# EasyEDA Pro project ProPrj_G4SC5.5开源版.epro, schematic G4SC5.5

## Sheets
1 主控: Board Name: G4SC5.5; Create Date: 2025-05-25; Page Name: 主控; Project Name: G4SC5.5开源版; Schematic Name: G4SC5.5; Update Date: 2025-05-25; Add into BOM: yes; Company: Your Company; Convert to PCB: yes; Date: 2023-09-22; Draw By: SUSTCDREAM; REV: 1.0; Sheet: 1/1
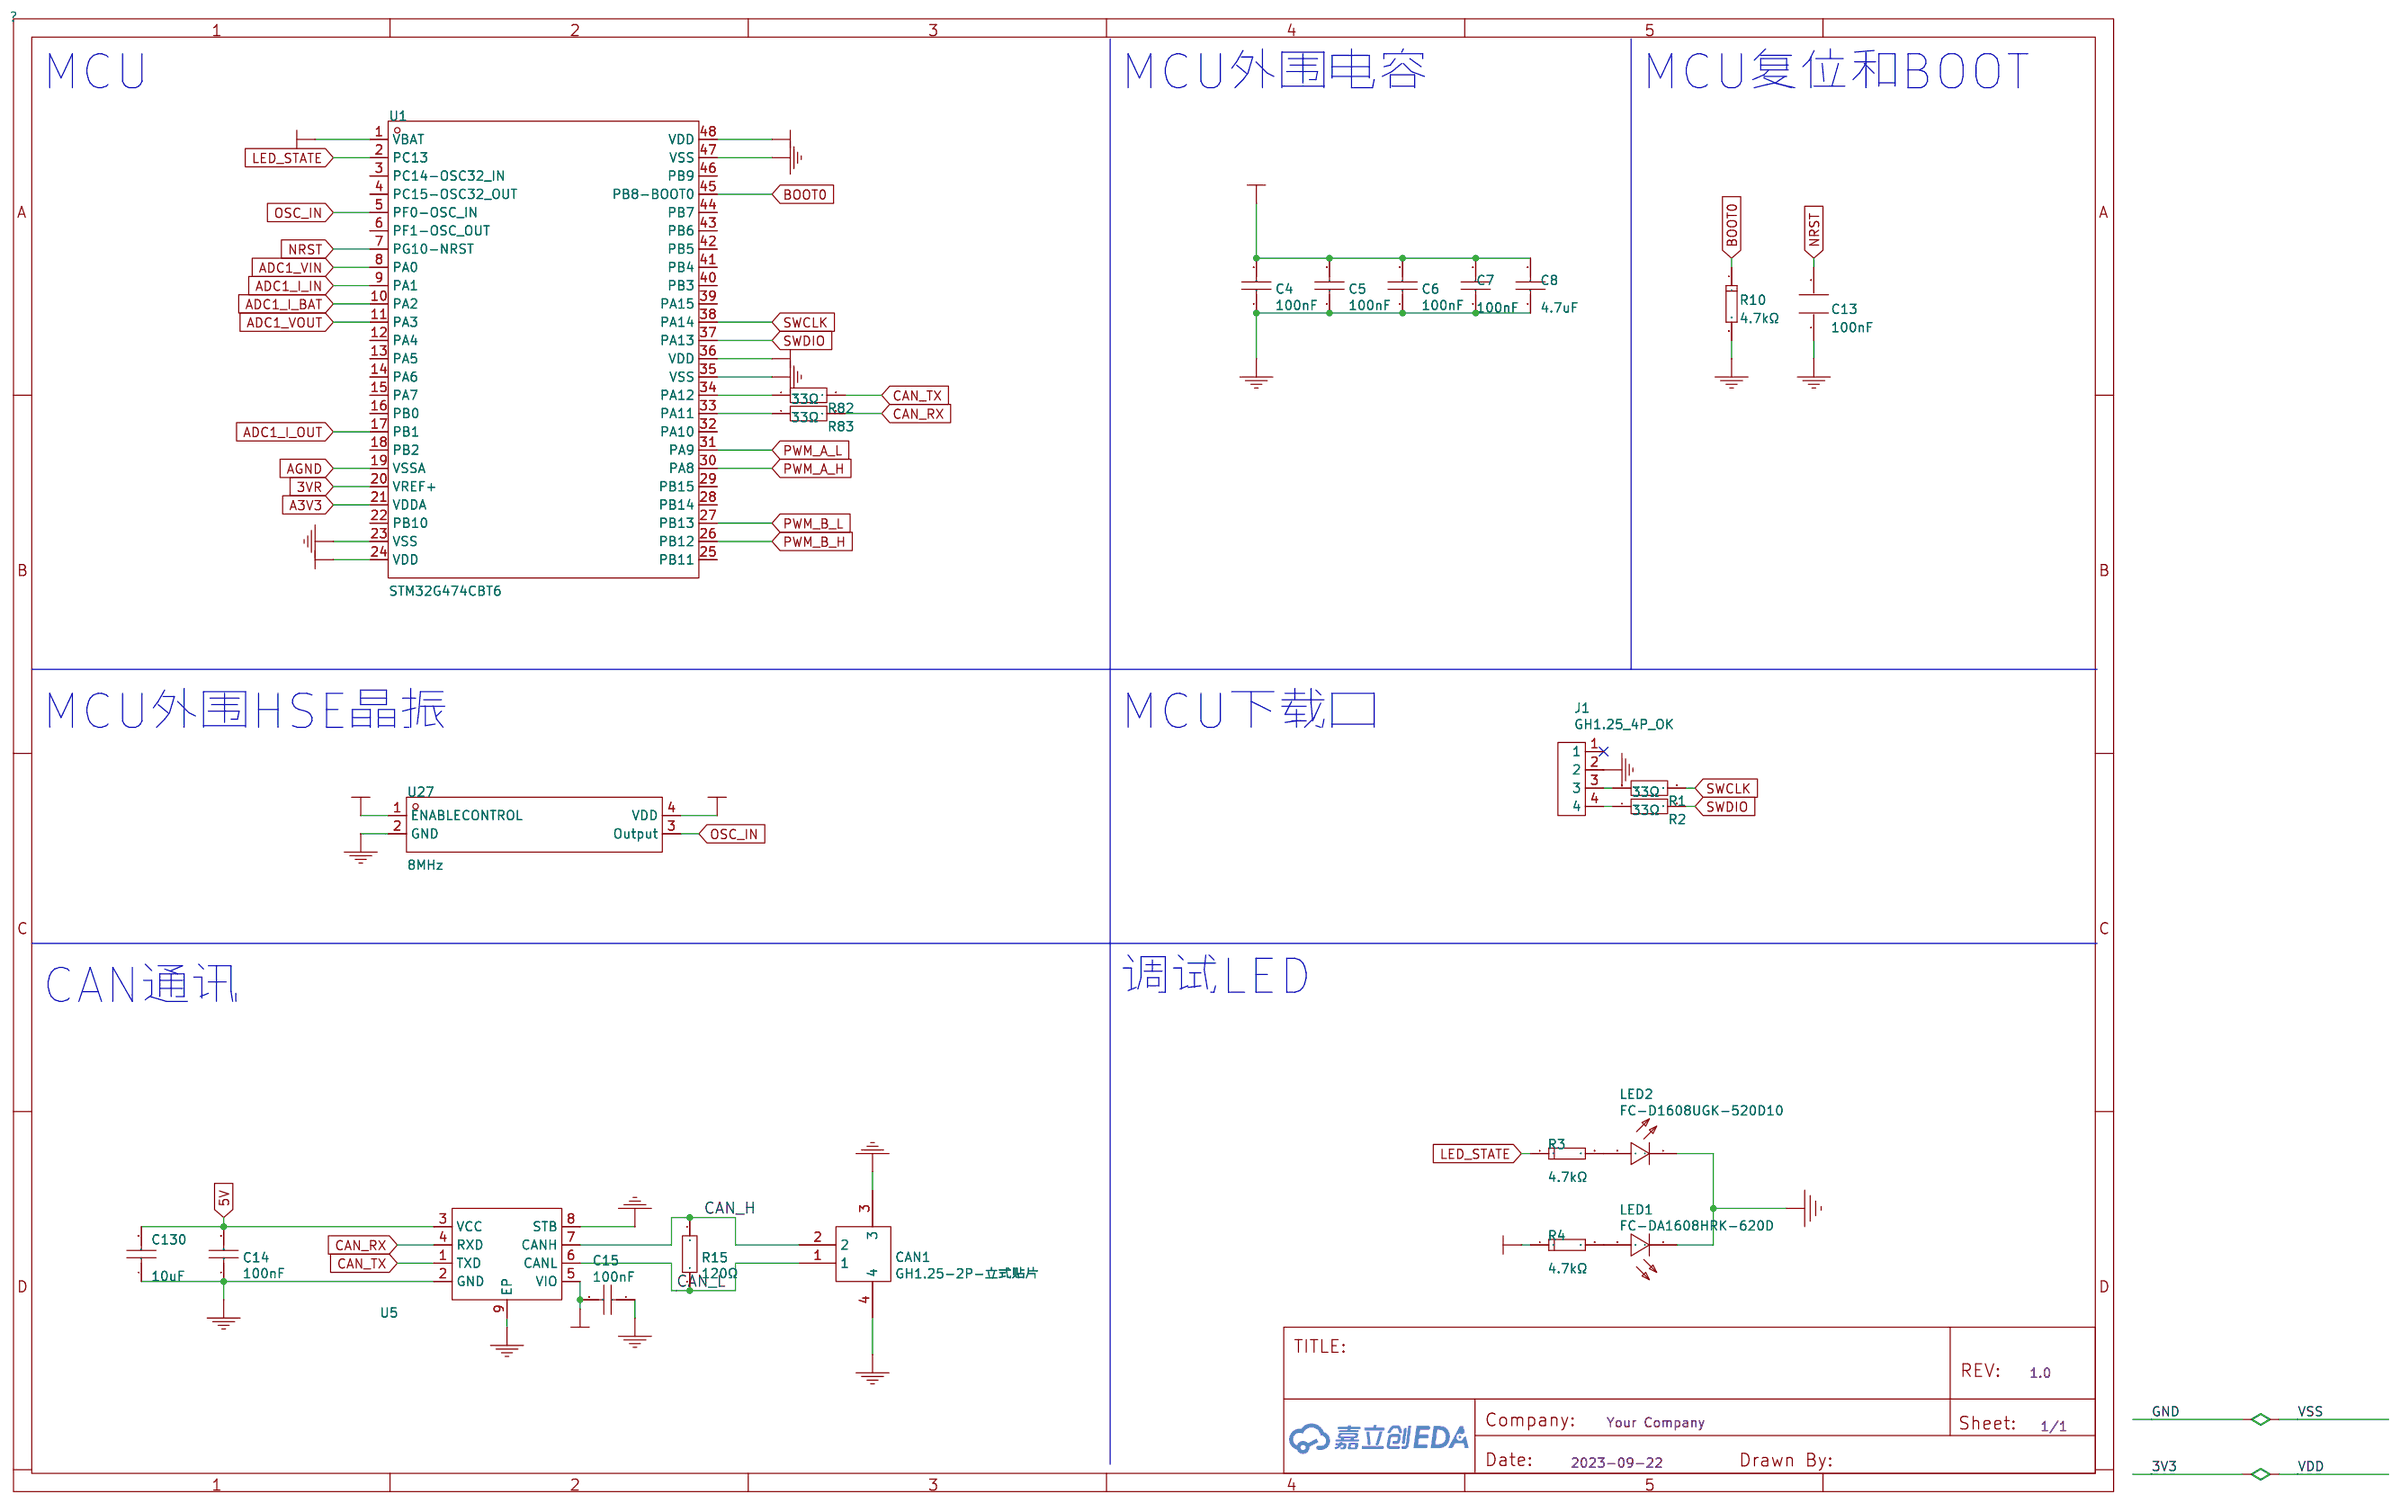
[diagram p0: 主控]
2 供电: Page Name: 供电
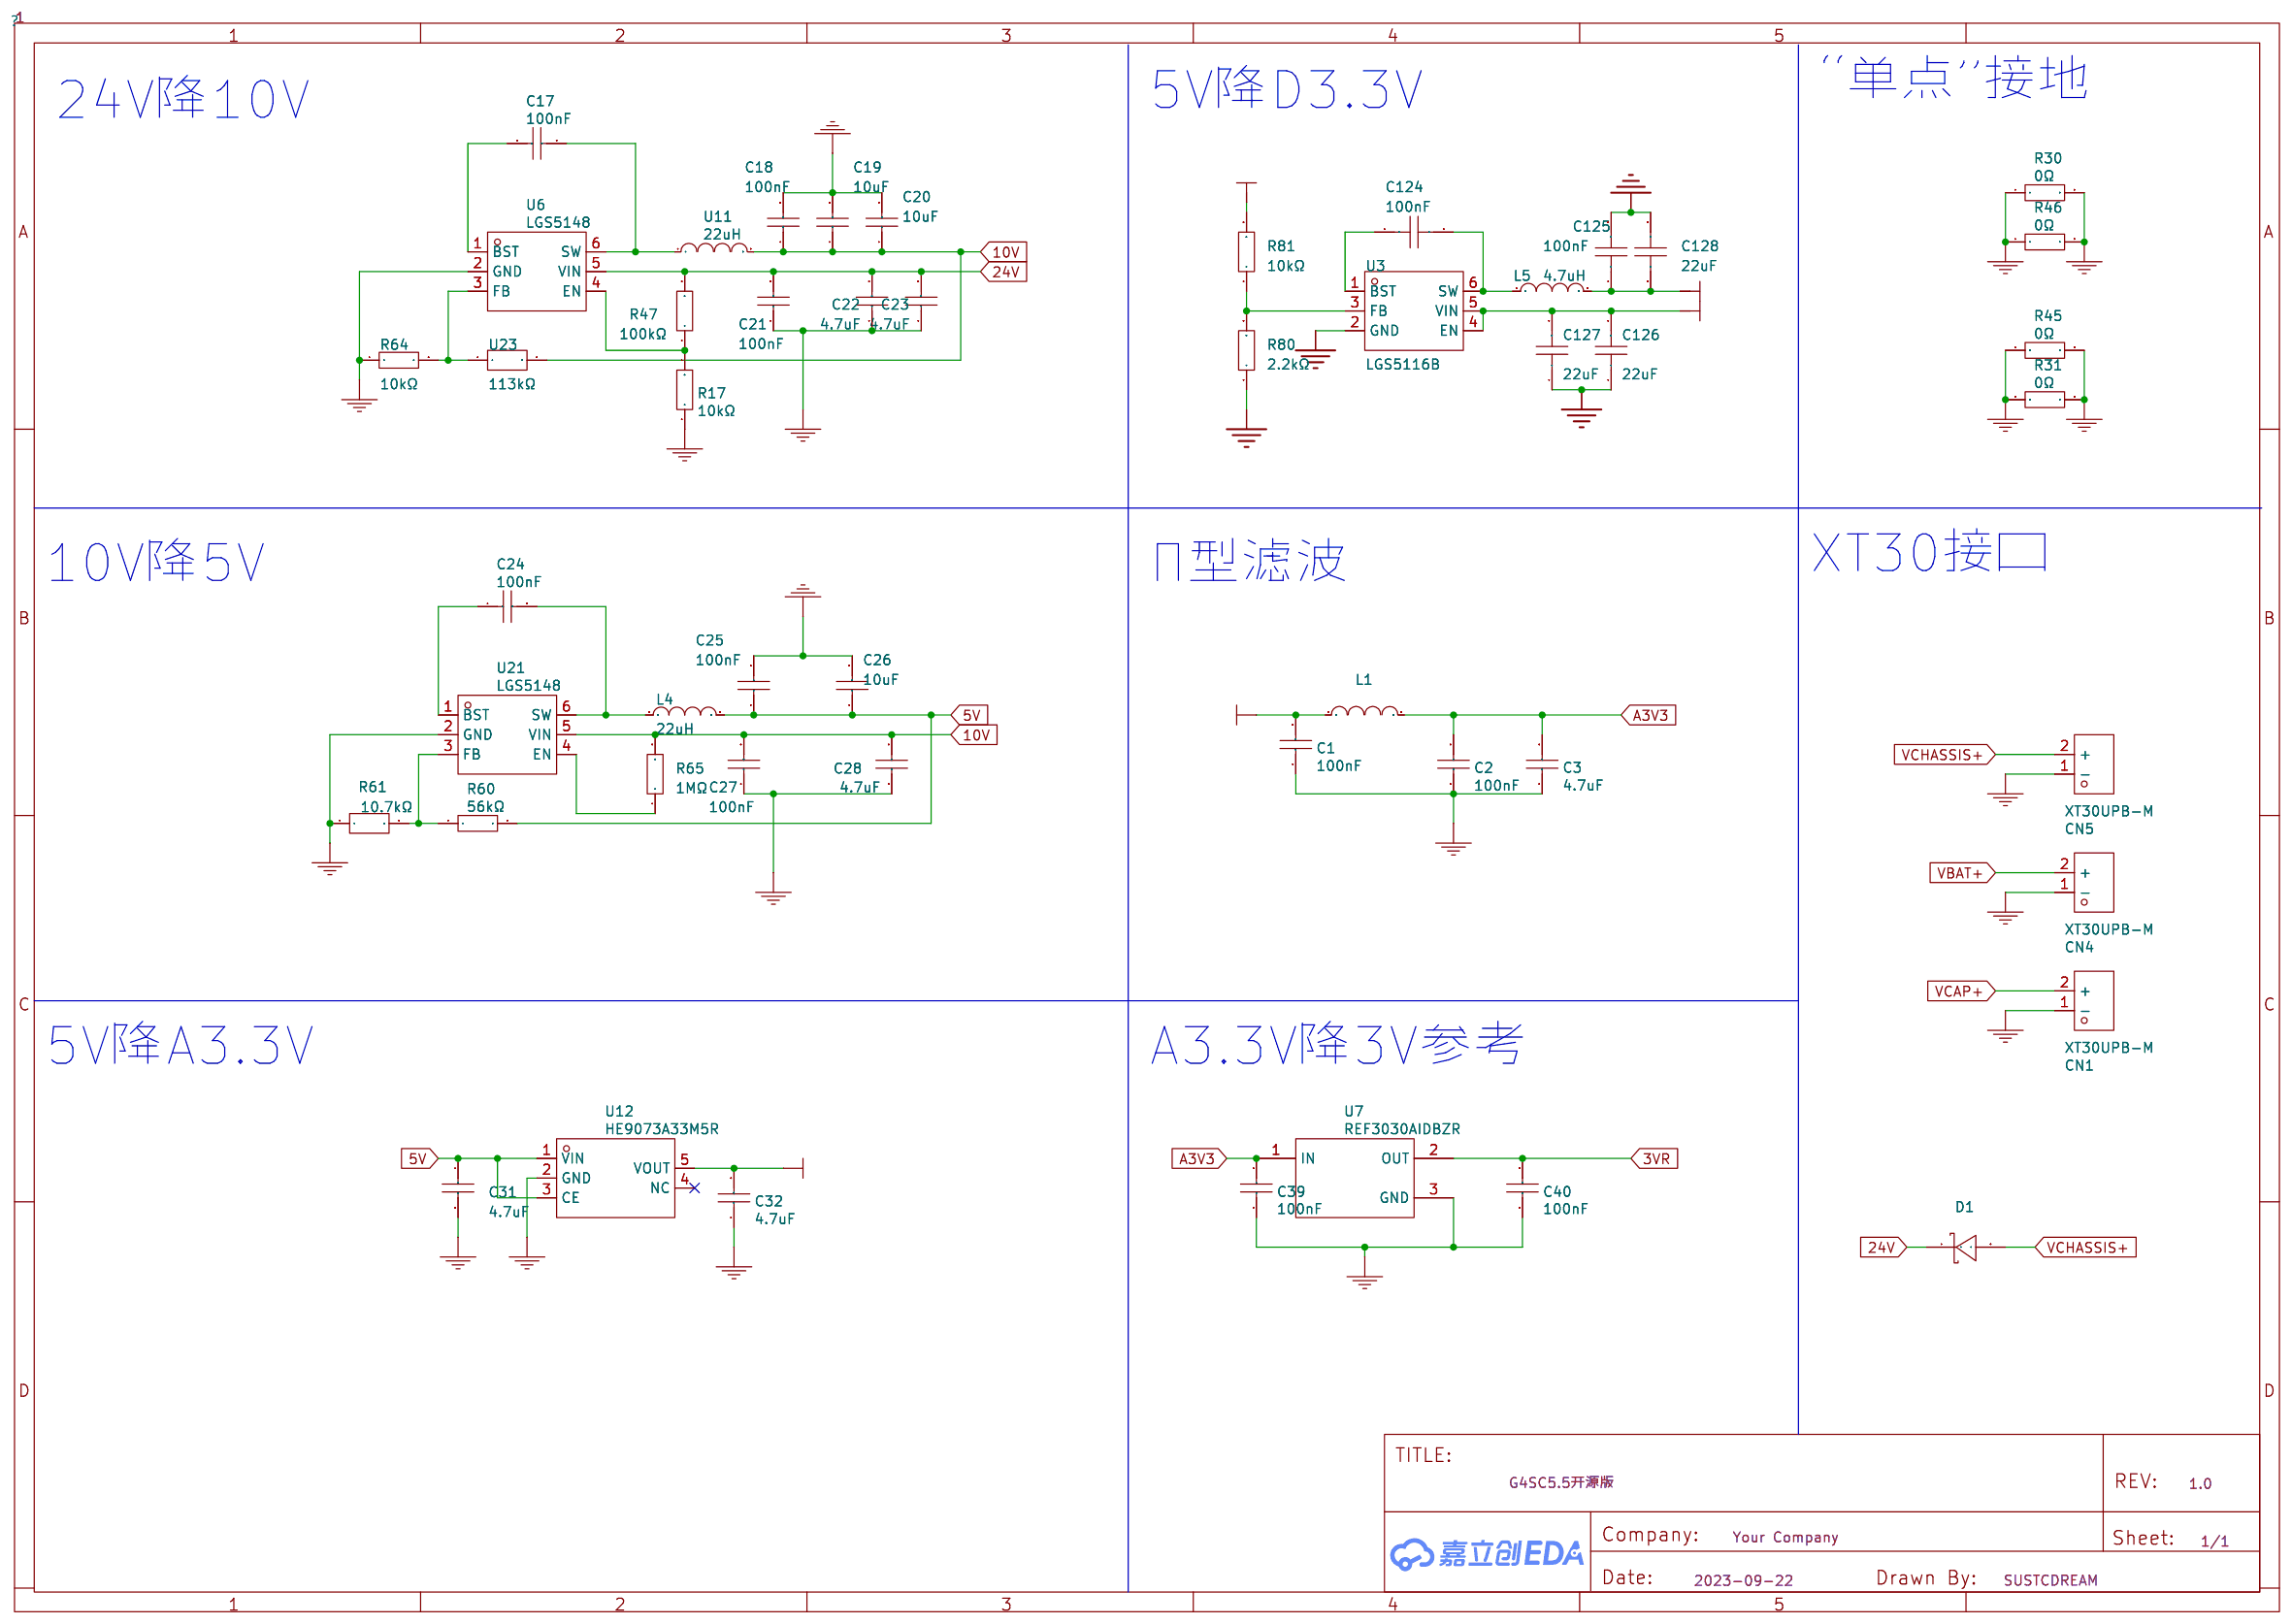
[diagram p1: 供电]
3 DCDC: Page Name: DCDC
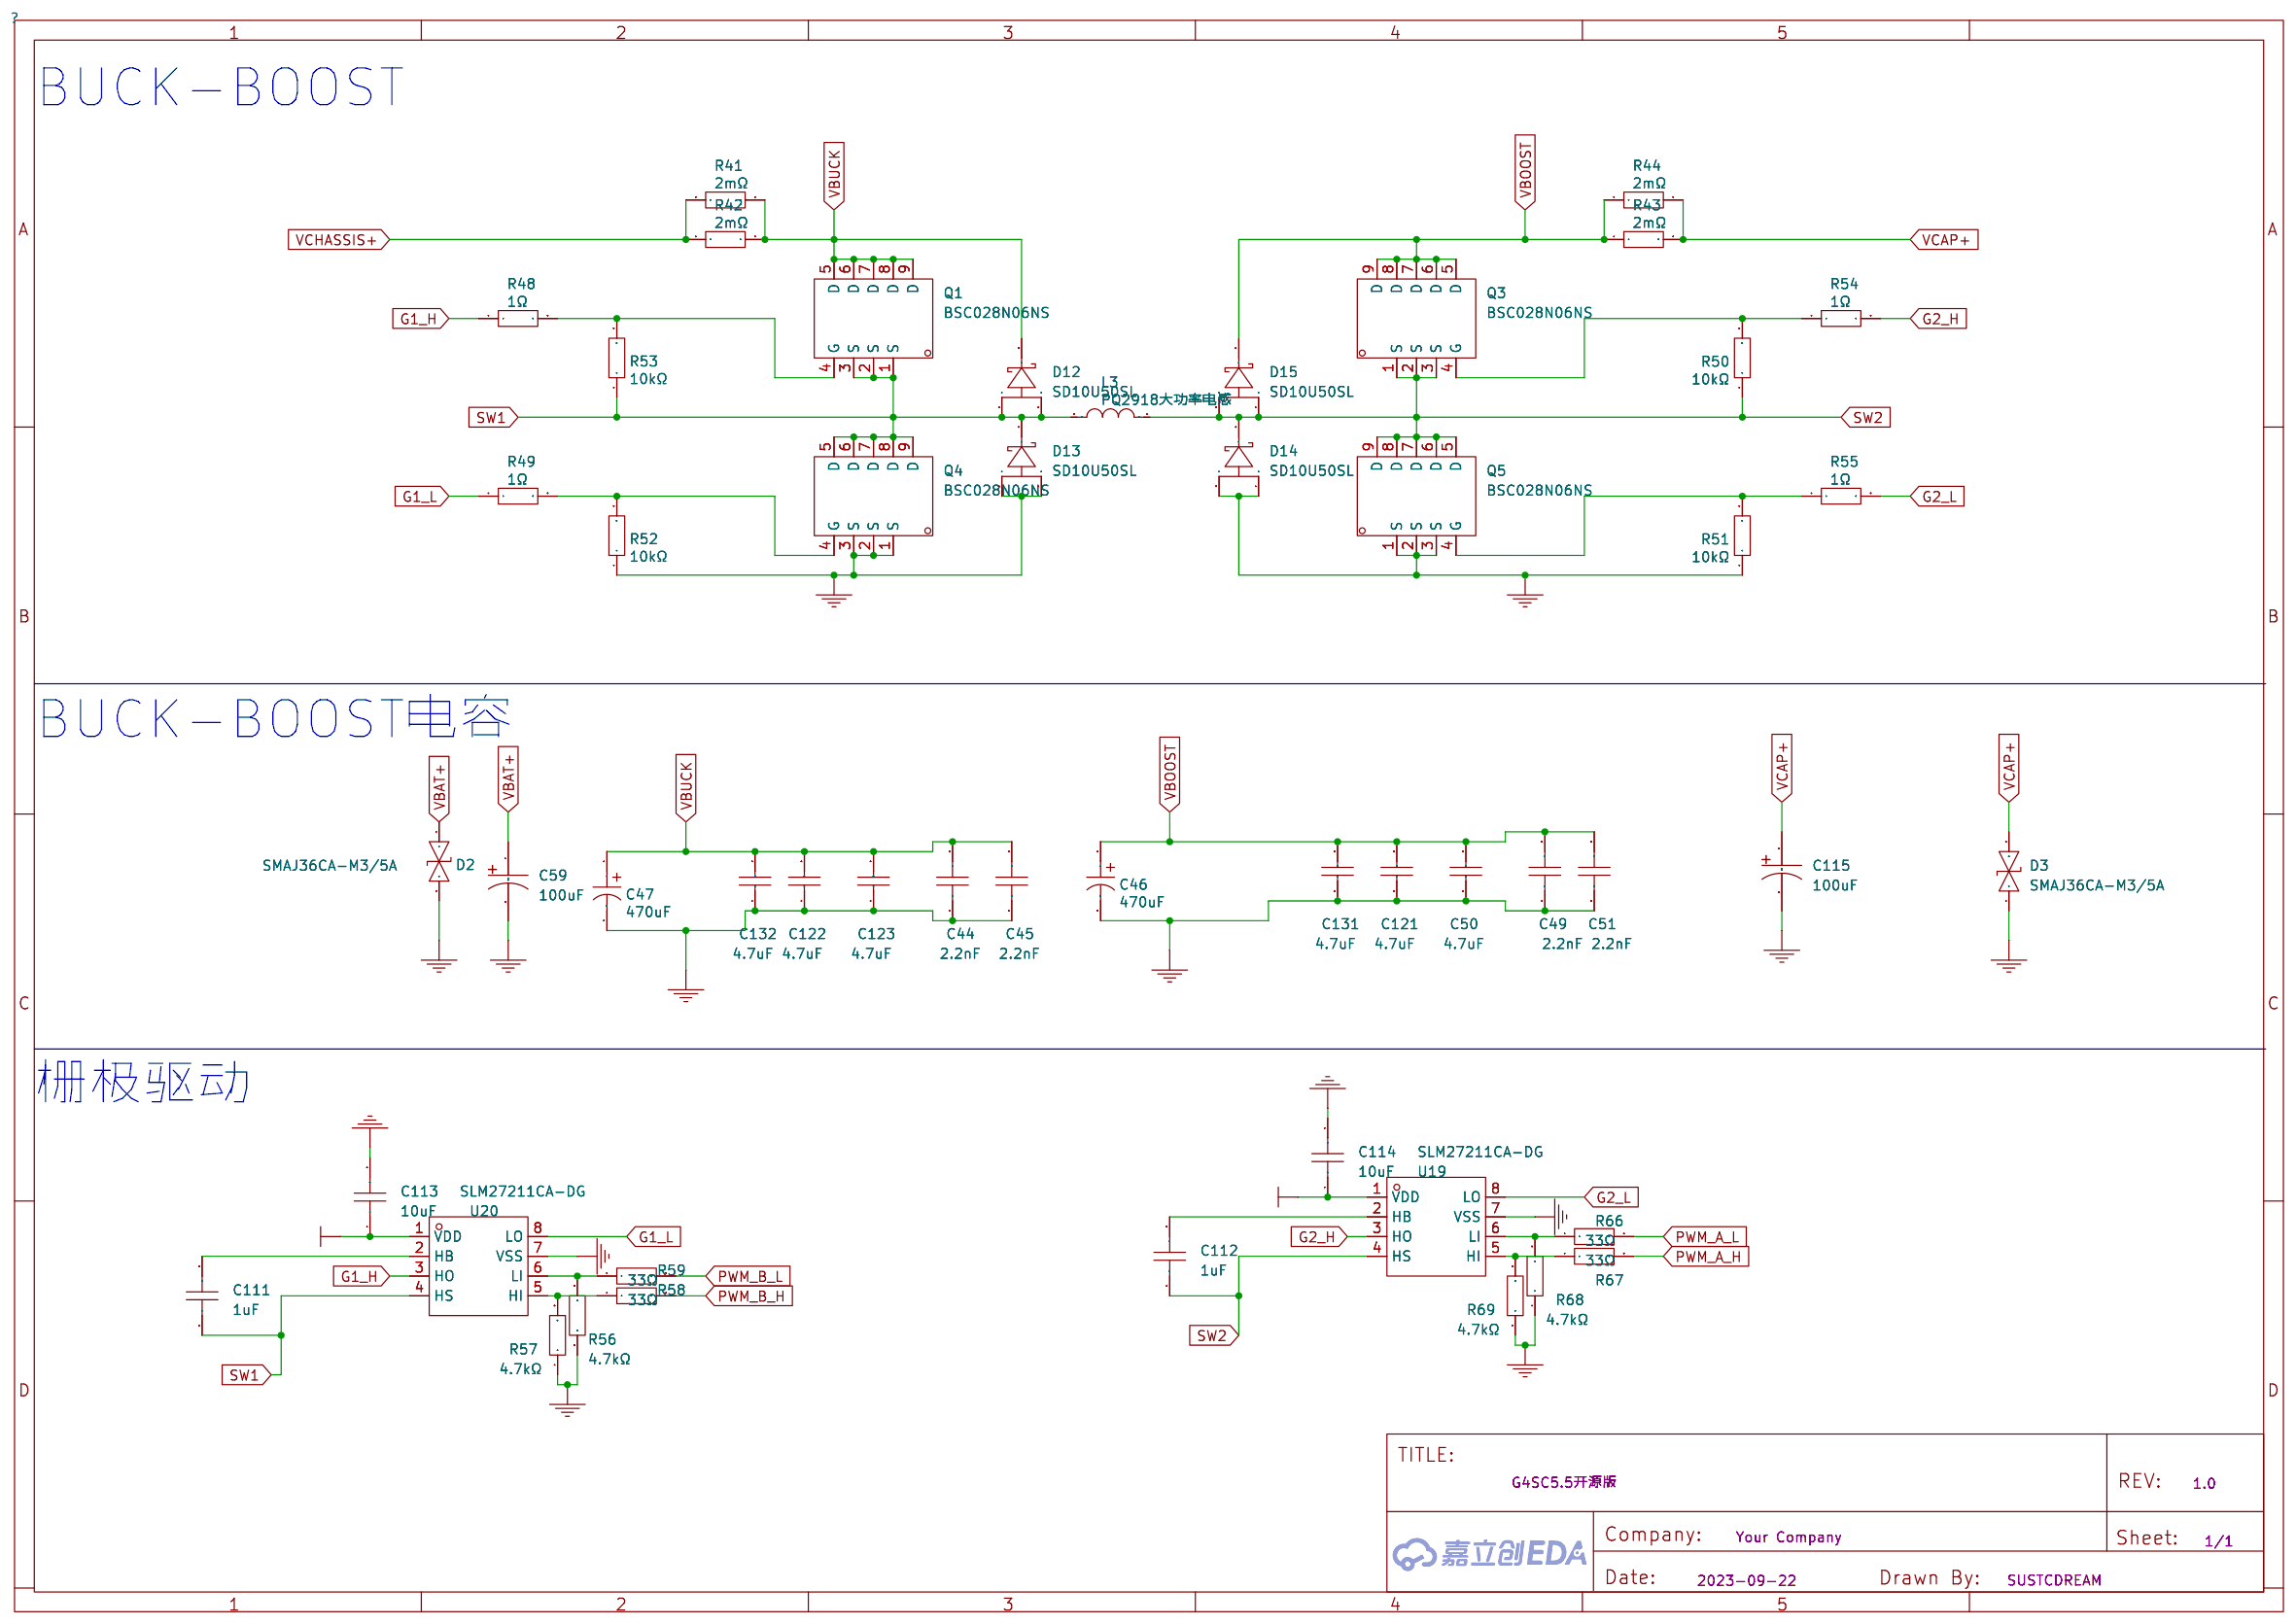
[diagram p2: DCDC]
4 模拟: Page Name: 模拟; Company: 嘉立创EDA; Page Size: A4; Version: V1.0
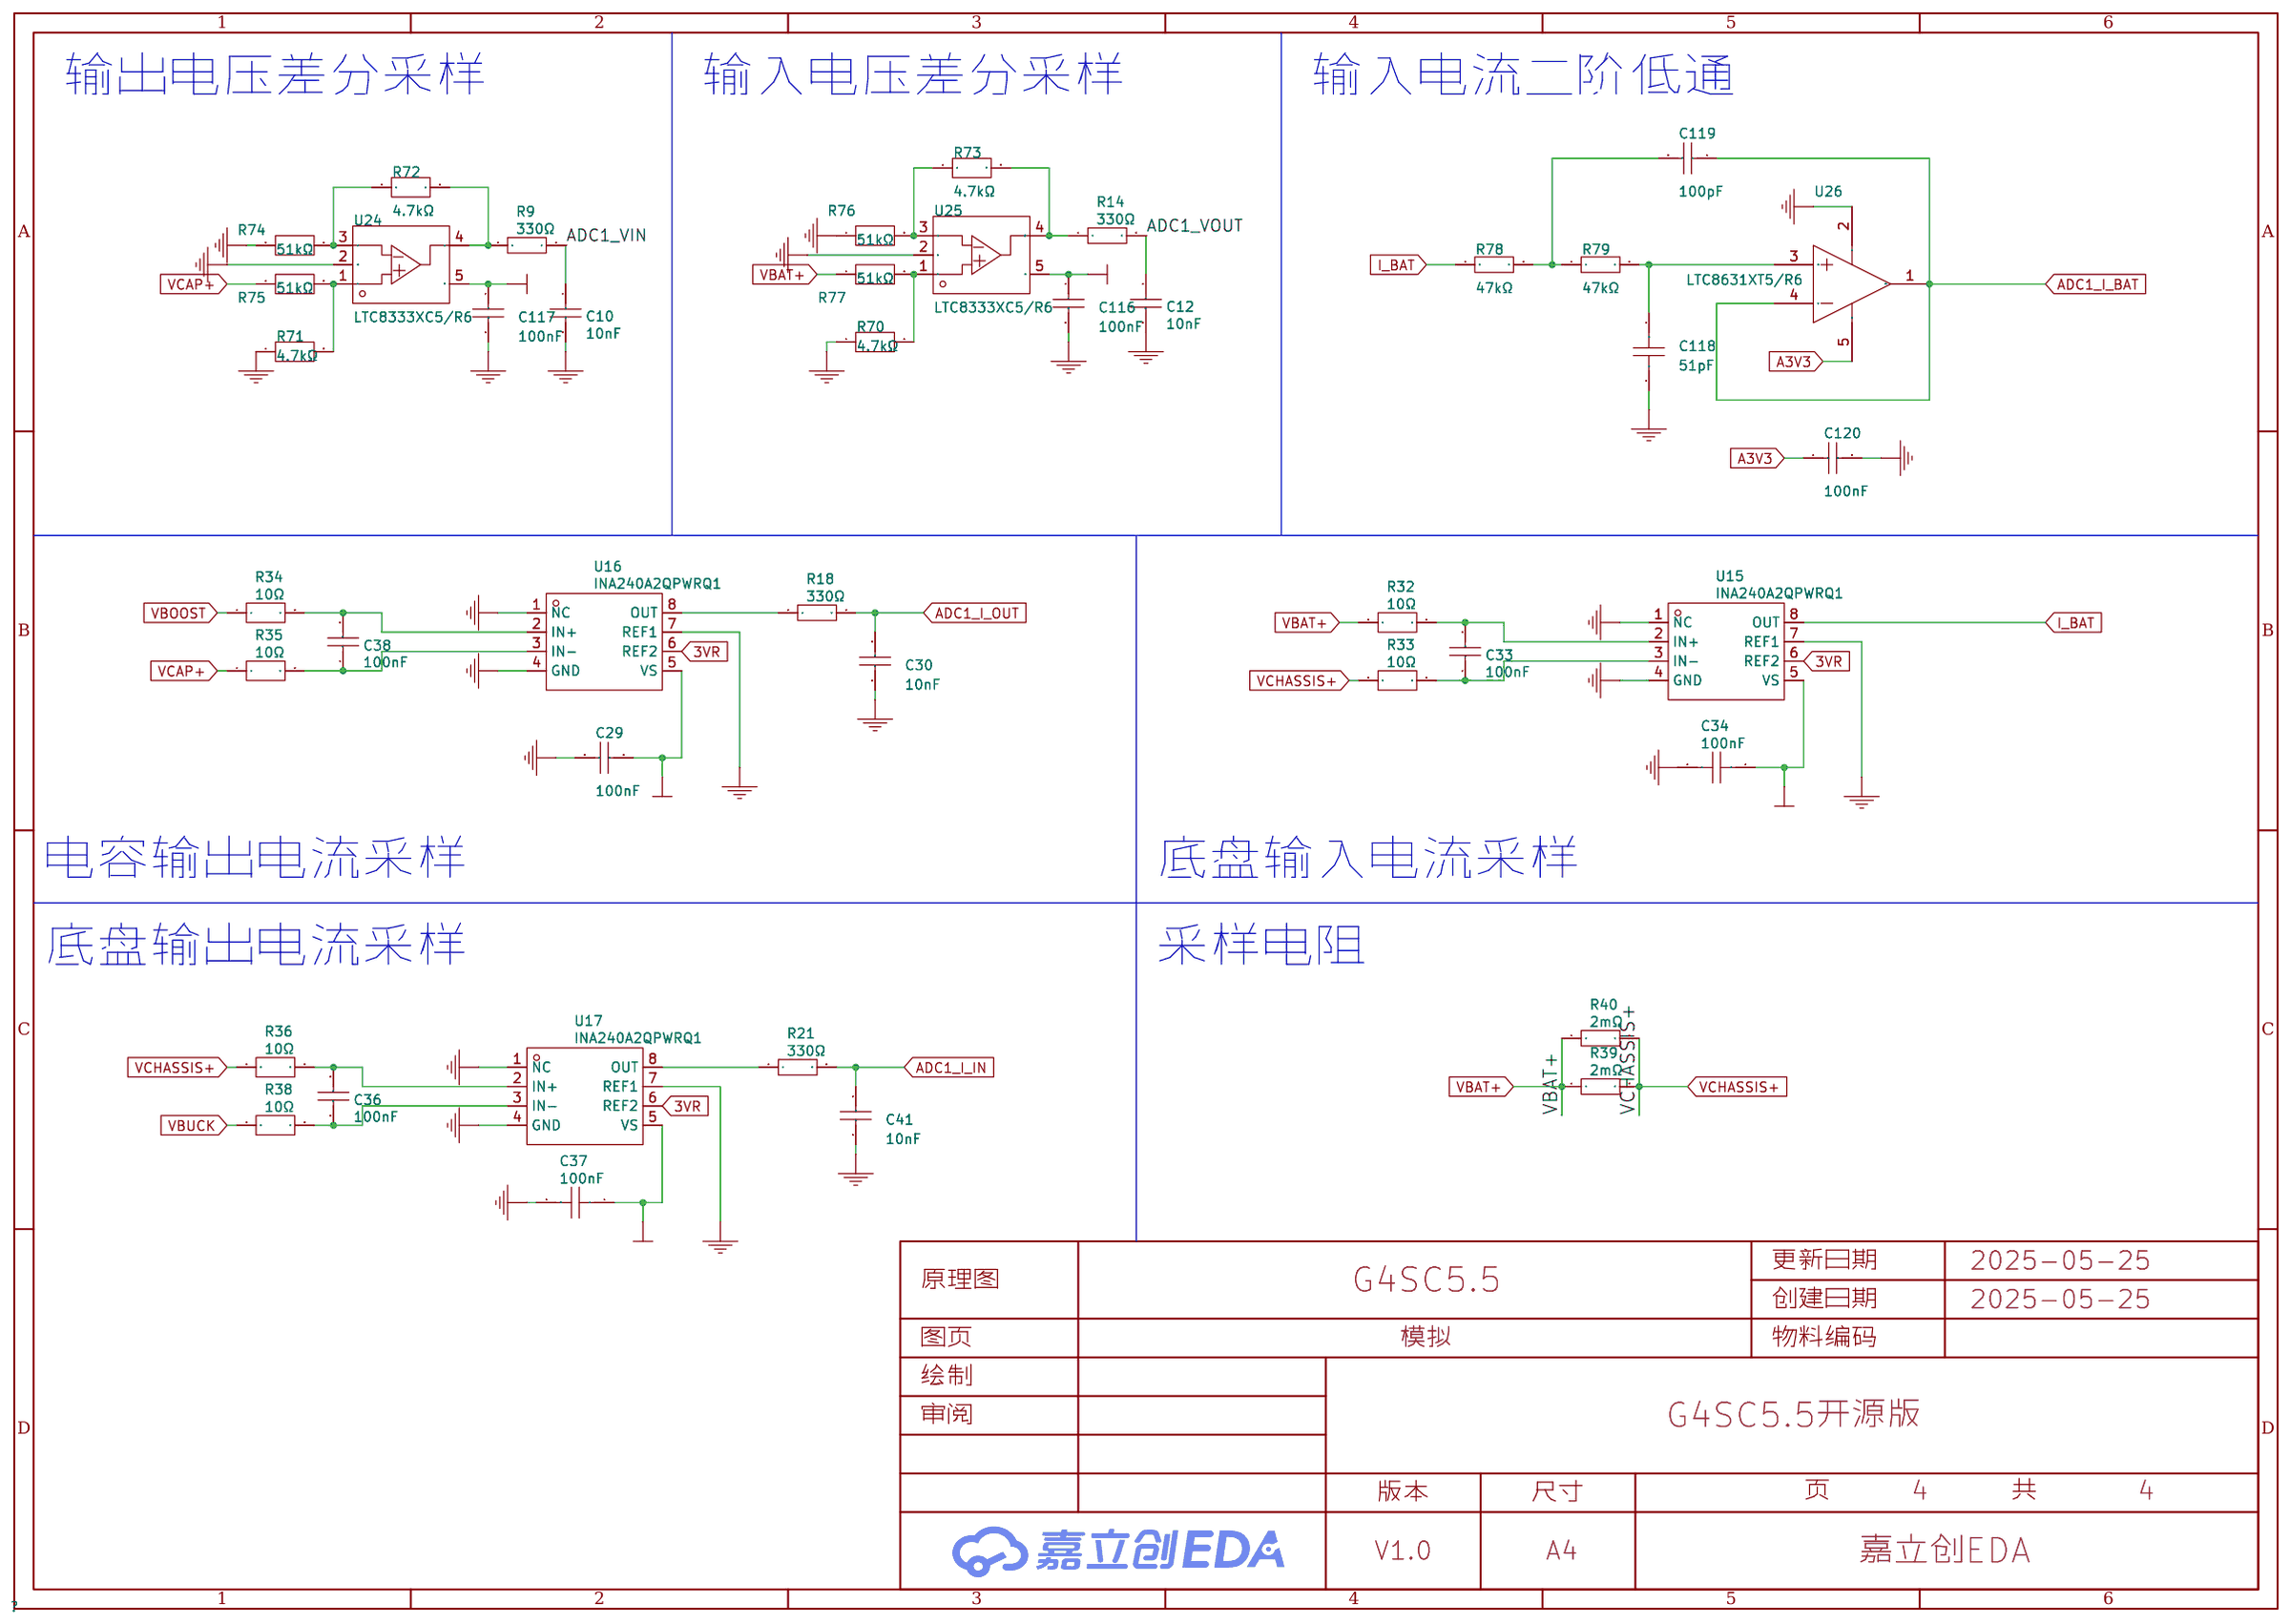
[diagram p3: 模拟]

## Parts
sheet DCDC
C44  2.2nF  [C0805]
C45  2.2nF  [C0805]
C46  470uF  [CAP-TH_BD10.0-P5.00-D0.6-FD]
C47  470uF  [CAP-TH_BD10.0-P5.00-D0.6-FD]
C49  2.2nF  [C0805]
C50  4.7uF  [C1206]
C51  2.2nF  [C0805]
C59  100uF  [footprint_08d0]
C111  1uF  [C0805]
C112  1uF  [C0805]
C113  10uF  [C0805]
C114  10uF  [C0805]
C115  100uF  [footprint_08d0]
C121  4.7uF  [C1206]
C122  4.7uF  [C1206]
C123  4.7uF  [C1206]
C131  4.7uF  [C1206]
C132  4.7uF  [C1206]
D2  SMAJ36CA-M3/5A  [footprint_4a09]
D3  SMAJ36CA-M3/5A  [footprint_d8e9]
D12  SD10U50SL  [TO-277_3P-L5.4-W4.0-LS6.5-BR]
D13  SD10U50SL  [TO-277_3P-L5.4-W4.0-LS6.5-BR]
D14  SD10U50SL  [TO-277_3P-L5.4-W4.0-LS6.5-BR]
D15  SD10U50SL  [TO-277_3P-L5.4-W4.0-LS6.5-BR]
L3  PQ2918大功率电感  [footprint_2825]
Q1  BSC028N06NS  [PG-TDSON-8_L5.0-W6.0-P1.27-LS6.2-BL-EP]
Q3  BSC028N06NS  [PG-TDSON-8_L5.0-W6.0-P1.27-LS6.2-BL-EP]
Q4  BSC028N06NS  [PG-TDSON-8_L5.0-W6.0-P1.27-LS6.2-BL-EP]
Q5  BSC028N06NS  [PG-TDSON-8_L5.0-W6.0-P1.27-LS6.2-BL-EP]
R41  2mΩ  [footprint_0379]
R42  2mΩ  [footprint_0379]
R43  2mΩ  [footprint_0379]
R44  2mΩ  [footprint_0379]
R48  1Ω  [R0603]
R49  1Ω  [R0603]
R50  10kΩ  [R0603]
R51  10kΩ  [R0603]
R52  10kΩ  [R0603]
R53  10kΩ  [R0603]
R54  1Ω  [R0603]
R55  1Ω  [R0603]
R56  4.7kΩ  [R0402]
R57  4.7kΩ  [R0402]
R58  33Ω  [R0402]
R59  33Ω  [R0402]
R66  33Ω  [R0402]
R67  33Ω  [R0402]
R68  4.7kΩ  [R0402]
R69  4.7kΩ  [R0402]
U19  SLM27211CA-DG  [SOIC-8_L4.9-W3.9-P1.27-LS6.0-BL]
U20  SLM27211CA-DG  [SOIC-8_L4.9-W3.9-P1.27-LS6.0-BL]
sheet 主控
C4  100nF  [C0402]
C5  100nF  [C0402]
C6  100nF  [C0402]
C7  100nF  [C0402]
C8  4.7uF  [C0402]
C13  100nF  [C0603]
C14  100nF  [C0603]
C15  100nF  [C0603]
C130  10uF  [C0805]
CAN1  GH1.25-2P-立式贴片  [footprint_47b1]
J1  GH1.25_4P_OK  [footprint_bfbb]
LED1  FC-DA1608HRK-620D  [footprint_1976]
LED2  FC-D1608UGK-520D10  [footprint_0091]
R1  33Ω  [R0402]
R2  33Ω  [R0402]
R3  4.7kΩ  [R0603]
R4  4.7kΩ  [R0603]
R10  4.7kΩ  [R0402]
R15  120Ω  [R0603]
R82  33Ω  [R0402]
R83  33Ω  [R0402]
U1  STM32G474CBT6  [LQFP-48_L7.0-W7.0-P0.50-LS9.0-BL]
U5  SIT1044QTK/3  [TDFN-8_L3.0-W3.0-P0.65-BL-EP]
U27  8MHz  [OSC-SMD_4P-L2.0-W1.6-BL]
sheet 供电
C1  100nF  [C0402]
C2  100nF  [C0402]
C3  4.7uF  [C0402]
C17  100nF  [C0603]
C18  100nF  [C0603]
C19  10uF  [C0805]
C20  10uF  [C0805]
C21  100nF  [C0603]
C22  4.7uF  [C0805]
C23  4.7uF  [C0805]
C24  100nF  [C0603]
C25  100nF  [C0603]
C26  10uF  [C0805]
C27  100nF  [C0603]
C28  4.7uF  [C0805]
C31  4.7uF  [C0402]
C32  4.7uF  [C0402]
C39  100nF  [C0402]
C40  100nF  [C0402]
C124  100nF  [C0603]
C125  100nF  [C0603]
C126  22uF  [C0805]
C127  22uF  [C0805]
C128  22uF  [C0603]
CN1  XT30UPB-M  [footprint_f264]
CN4  XT30UPB-M  [footprint_f264]
CN5  XT30UPB-M  [footprint_5e48]
D1  SS210  [SMA_L4.3-W2.6-LS5.2-RD]
L1  GZ1608D601TF  [L0603]
L4  22uH  [IND-SMD_L2.5-W2.0_MHCHL2520]
L5  4.7uH  [IND-SMD_L2.0-W1.6-B]
R17  10kΩ  [R0603]
R30  0Ω  [footprint_0952]
R31  0Ω  [footprint_0952]
R45  0Ω  [footprint_0952]
R46  0Ω  [footprint_0952]
R47  100kΩ  [R0603]
R60  56kΩ  [R0603]
R61  10.7kΩ  [R0603]
R64  10kΩ  [R0603]
R65  1MΩ  [R0603]
R80  2.2kΩ  [R0603]
R81  10kΩ  [R0603]
U3  LGS5116B  [SOT-23-6_L2.9-W1.6-P0.95-LS2.8-BR]
U6  LGS5148  [footprint_d9ac]
U7  REF3030AIDBZR  [footprint_6933]
U11  22uH  [IND-SMD_L2.5-W2.0_MHCHL2520]
U12  HE9073A33M5R  [footprint_751e]
U21  LGS5148  [footprint_d9ac]
U23  113kΩ  [R0603]
sheet 模拟
C10  10nF  [C0603]
C12  10nF  [C0603]
C29  100nF  [C0402]
C30  10nF  [C0402]
C33  100nF  [C0402]
C34  100nF  [C0402]
C36  100nF  [C0402]
C37  100nF  [C0402]
C38  100nF  [C0402]
C41  10nF  [C0402]
C116  100nF  [C0402]
C117  100nF  [C0402]
C118  51pF  [C0402]
C119  100pF  [C0402]
C120  100nF  [C0402]
R9  330Ω  [R0603]
R14  330Ω  [R0603]
R18  330Ω  [R0402]
R21  330Ω  [R0402]
R32  10Ω  [R0402]
R33  10Ω  [R0402]
R34  10Ω  [R0402]
R35  10Ω  [R0402]
R36  10Ω  [R0402]
R38  10Ω  [R0402]
R39  2mΩ  [footprint_0379]
R40  2mΩ  [footprint_0379]
R70  4.7kΩ  [R0603]
R71  4.7kΩ  [R0603]
R72  4.7kΩ  [R0603]
R73  4.7kΩ  [R0603]
R74  51kΩ  [R0603]
R75  51kΩ  [R0603]
R76  51kΩ  [R0603]
R77  51kΩ  [R0603]
R78  47kΩ  [R0402]
R79  47kΩ  [R0402]
U15  INA240A2QPWRQ1  [footprint_93e1]
U16  INA240A2QPWRQ1  [footprint_93e1]
U17  INA240A2QPWRQ1  [footprint_93e1]
U24  LTC8333XC5/R6  [SC-70-5_L2.1-W1.3-P0.65-LS2.1-BR]
U25  LTC8333XC5/R6  [SC-70-5_L2.1-W1.3-P0.65-LS2.1-BR]
U26  LTC8631XT5/R6  [SOT-23-5_L3.0-W1.7-P0.95-LS2.8-BR]

## Library data of the parts
C44 C45 C49 C51 = CL21C222JBFNNNE: 容值:2.2nF;精度:±5%;额定电压:50V;材质(温度系数):C0G;; LCSC Part Name: 2.2nF ±5% 50V; Supplier Part: C28260; Manufacturer: SAMSUNG(三星); Supplier Footprint: 0805; JLCPCB Part Class: Basic Part; Datasheet: https://atta.szlcsc.com/upload/public/pdf/source/20160218/1457707763339.pdf; Supplier: LCSC; Tolerance: ±5%; Voltage Rated: 50V; Temperature Coefficient: C0G; link: https://so.szlcsc.com/global.html?k=C472844&amp;ref=editor; Check: true
C46 C47 = SPZ1HM471G18O00RAXXX: 容值:470uF;精度:±20%;额定电压:50V;纹波电流:-;等效串联电阻:-;类型:-;; LCSC Part Name: 470uF ±20% 50V; Supplier Part: C2688262; Manufacturer: AISHI(艾华集团); Supplier Footprint: 插件,D10xL18mm; JLCPCB Part Class: Extended Part; Datasheet: https://atta.szlcsc.com/upload/public/pdf/source/20180906/C160181_A9A2ACDA3CC278FCDBAF747E681A6DA5.pdf; Supplier: LCSC; Tolerance: ±20%; Rated Voltage: 50V; link: https://so.szlcsc.com/global.html?k=C2688262&amp;ref=editor; Check: true
C50 C121-C123 C131 C132 = 1206B475K500NT: 容值:4.7uF;精度:±10%;额定电压:50V;材质(温度系数):X7R;; LCSC Part Name: 4.7uF ±10% 50V; Supplier Part: C29823; Manufacturer: FH(风华); Supplier Footprint: 1206; JLCPCB Part Class: Basic Part; Datasheet: https://atta.szlcsc.com/upload/public/pdf/source/20200305/C486355_26A10D38EF8C2A5C37091D0039909270.pdf; Supplier: LCSC; Tolerance: ±10%; Voltage Rated: 50V; Temperature Coefficient: X7R; link: https://so.szlcsc.com/global.html?k=C51205&amp;ref=editor; Check: true
C59 C115 = 100uF: Supplier: LCSC; Supplier Part: C171434; Manufacturer: Aihua Group; Manufacturer Part: SPZ1HM101F09O00RAXXX; JLCPCB Part Class: Extended Part; Check: false
C111 C112 = CL21B105KBFNNNE: 容值:1uF;精度:±10%;额定电压:50V;材质(温度系数):X7R;; LCSC Part Name: 1uF ±10% 50V; Supplier Part: C28323; Manufacturer: SAMSUNG(三星); Supplier Footprint: 0805; JLCPCB Part Class: Basic Part; Datasheet: https://atta.szlcsc.com/upload/public/pdf/source/20160218/1457707763339.pdf; Supplier: LCSC; Tolerance: ±10%; Voltage Rated: 50V; Temperature Coefficient: X7R
C113 C114 = CL21A106KAYNNNE_C15850: 容值:10uF;精度:±10%;额定电压:25V;材质(温度系数):X5R;; LCSC Part Name: 10uF ±10% 25V; Supplier Part: C15850; Manufacturer: SAMSUNG(三星); Manufacturer Part: CL21A106KAYNNNE; Supplier Footprint: 0805; JLCPCB Part Class: Basic Part; Datasheet: https://atta.szlcsc.com/upload/public/pdf/source/20160218/1457707763339.pdf; Supplier: LCSC; Tolerance: ±10%; Voltage Rated: 25V; Temperature Coefficient: X5R
D2 D3 = SMAJ36CA-M3/5A: Supplier: LCSC; Supplier Part: C1978800; Manufacturer: VISHAY(威世); JLCPCB Part Class: Extended Part; link: https://so.szlcsc.com/global.html?k=C1978800&amp;ref=editor; Check: false
D12-D15 = SD10U50SL: 二极管配置:独立式;正向压降(Vf):450mV@10A;直流反向耐压(Vr):50V;平均整流电流(Io):10A;; LCSC Part Name: 电压:50V 电流:10A; Supplier Part: C2848288; Manufacturer: LGE(鲁光); Supplier Footprint: TO-277; Datasheet: https://atta.szlcsc.com/upload/public/pdf/source/20210721/C2848288_0603D400F61DE6050879908085AD8DFD.pdf; Supplier: LCSC; Diode Configuration: 独立式; Forward Voltage (Vf@If): 450mV@10A; Reverse Voltage (Vr): 50V; Average Rectified Current (Io): 10A; Reverse Leakage Current (Ir): 300uA@50V
L3 = PQ2918大功率电感: Check: false
Q1 Q3-Q5 = BSC028N06NS_C148250: 类型:1个N沟道;漏源电压(Vdss):60V;连续漏极电流(Id):23A;功率(Pd):2.5W;导通电阻(RDS(on)@Vgs,Id):2.8mΩ@10V,50A;阈值电压(Vgs(th)@Id):2.8V@50uA;; LCSC Part Name: 1个N沟道 耐压:60V 电流:23A; Supplier Part: C148250; Manufacturer: Infineon(英飞凌); Supplier Footprint: TDSON-8-EP(5x6); JLCPCB Part Class: 扩展库; Datasheet: https://atta.szlcsc.com/upload/public/pdf/source/20190819/C412733_81C9F5F540EFB58D034143B21E97C957.pdf; Supplier: LCSC; Type: 1个N沟道; Drain Source Voltage (Vdss): 60V; Continuous Drain Current (Id): 23A; Power Dissipation (Pd): 2.5W; Drain Source On Resistance (RDS(on)@Vgs,Id): 2.8mΩ@10V,50A; Gate Threshold Voltage (Vgs(th)@Id): 2.8V@50uA
R39-R44 = 2mΩ: Supplier: LCSC; Supplier Part: C163090; Manufacturer: 大毅科技; Manufacturer Part: RLM10FTSMR002; JLCPCB Part Class: Extended Part; link: https://so.szlcsc.com/global.html?k=C163090&amp;ref=editor; Check: false
R48 R49 R54 R55 = 0603WAF100KT5E: 电阻类型:厚膜电阻;阻值:1Ω;精度:±1%;功率:100mW;最大工作电压:75V;温度系数:±400ppm/℃;; LCSC Part Name: 1Ω ±1% 100mW 厚膜电阻; Supplier Part: C22936; Manufacturer: UNI-ROYAL(厚声); Supplier Footprint: 0603; JLCPCB Part Class: Basic Part; Datasheet: https://atta.szlcsc.com/upload/public/pdf/source/20200306/C422600_1E6D84923E4A46A82E41ADD87F860B5C.pdf; Supplier: LCSC; Type: 厚膜电阻; Tolerance: ±1%; Power(Watts): 100mW; Overload Voltage (Max): 75V; Temperature Coefficient: ±400ppm/℃; Operating Temperature Range: -55℃~+155℃; link: https://so.szlcsc.com/global.html?k=C22979&amp;ref=editor; Check: true
R50-R53 = 0603WAF1002T5E: 电阻类型:厚膜电阻;阻值:10kΩ;精度:±1%;功率:100mW;最大工作电压:75V;温度系数:±100ppm/℃;; LCSC Part Name: 厚膜电阻 10kΩ ±1% 100mW; Supplier Part: C25804; Manufacturer: UNI-ROYAL(厚声); Supplier Footprint: 0603; JLCPCB Part Class: Basic Part; Datasheet: https://atta.szlcsc.com/upload/public/pdf/source/20200306/C422600_1E6D84923E4A46A82E41ADD87F860B5C.pdf; Supplier: LCSC; Type: 厚膜电阻; Tolerance: ±1%; Power(Watts): 100mW; Overload Voltage (Max): 75V; Temperature Coefficient: ±100ppm/℃; Operating Temperature Range: -55℃~+155℃; link: https://so.szlcsc.com/global.html?k=C25804&ref=editor; Check: true
R10 R56 R57 R68 R69 = 0402WGF4701TCE: 电阻类型:厚膜电阻;阻值:4.7kΩ;精度:±1%;功率:62.5mW;最大工作电压:50V;温度系数:±100ppm/℃;; LCSC Part Name: 4.7kΩ ±1% 62.5mW 厚膜电阻; Supplier Part: C25900; Manufacturer: UNI-ROYAL(厚声); Supplier Footprint: 0402; JLCPCB Part Class: Basic Part; Datasheet: https://atta.szlcsc.com/upload/public/pdf/source/20200306/C422600_1E6D84923E4A46A82E41ADD87F860B5C.pdf; Supplier: LCSC; Type: 厚膜电阻; Tolerance: ±1%; Power(Watts): 62.5mW; Overload Voltage (Max): 50V; Temperature Coefficient: ±100ppm/℃; Operating Temperature Range: -55℃~+155℃
R1 R2 R58 R59 R66 R67 R82 R83 = 0402WGF330JTCE: 电阻类型:厚膜电阻;阻值:33Ω;精度:±1%;功率:62.5mW;最大工作电压:50V;温度系数:±100ppm/℃;; LCSC Part Name: 33Ω ±1% 62.5mW 厚膜电阻; Supplier Part: C25105; Manufacturer: UNI-ROYAL(厚声); Supplier Footprint: 0402; JLCPCB Part Class: Basic Part; Datasheet: https://atta.szlcsc.com/upload/public/pdf/source/20200306/C422600_1E6D84923E4A46A82E41ADD87F860B5C.pdf; Supplier: LCSC; Type: 厚膜电阻; Tolerance: ±1%; Power(Watts): 62.5mW; Overload Voltage (Max): 50V; Temperature Coefficient: ±100ppm/℃; Operating Temperature Range: -55℃~+155℃
U19 U20 = SLM27211CA-DG: 驱动配置:上下管驱动;驱动通道数:2;峰值灌电流:3A;峰值拉电流:4.5A;电源电压:8V~17V;是否隔离:非隔离;; Supplier: LCSC; Supplier Part: C967931; Manufacturer: Sillumin(数明半导体); JLCPCB Part Class: 扩展库; Supplier Footprint: SOP-8; Datasheet: https://atta.szlcsc.com/upload/public/pdf/source/20230728/EA1F827EBB501F8DDB1AD69B834D49D4.pdf; Driven Configuration: 上下管驱动; Number of Drivers: 2; Peak Output Current(sink): 3A; Peak Output Current(source): 4.5A; Supply Voltage: 8V~17V; Whether the isolation: 非隔离
C1 C2 C4-C7 C29 C33 C34 C36-C40 C116 C117 C120 = CL05B104KO5NNNC: 容值:100nF;精度:±10%;额定电压:16V;材质(温度系数):X7R;; LCSC Part Name: 100nF ±10% 16V; Supplier Part: C1525; Manufacturer: SAMSUNG(三星); Supplier Footprint: 0402; JLCPCB Part Class: Basic Part; Datasheet: https://atta.szlcsc.com/upload/public/pdf/source/20160218/1457707763339.pdf; Supplier: LCSC; Tolerance: ±10%; Voltage Rated: 16V; Temperature Coefficient: X7R
C3 C8 C31 C32 = CL05A475MP5NRNC: 容值:4.7uF;精度:±20%;额定电压:10V;材质(温度系数):X5R;; LCSC Part Name: 4.7uF ±20% 10V; Supplier Part: C23733; Manufacturer: SAMSUNG(三星); Supplier Footprint: 0402; JLCPCB Part Class: Basic Part; Datasheet: https://atta.szlcsc.com/upload/public/pdf/source/20160218/1457707763339.pdf; Supplier: LCSC; Tolerance: ±20%; Voltage Rated: 10V; Temperature Coefficient: X5R
C13-C15 C17 C18 C21 C24 C25 C27 C124 C125 = CC0603KRX7R9BB104: 容值:100nF;精度:±10%;额定电压:50V;材质(温度系数):X7R;; LCSC Part Name: 100nF ±10% 50V; Supplier Part: C14663; Manufacturer: YAGEO(国巨); Supplier Footprint: 0603; JLCPCB Part Class: Basic Part; Datasheet: https://atta.szlcsc.com/upload/public/pdf/source/20180910/C282072_33301C7F631E79921B82A8DAC6BCC5B3.pdf; Supplier: LCSC; Tolerance: ±10%; Voltage Rated: 50V; Temperature Coefficient: X7R
C19 C20 C26 C130 = GRM21BR61H106KE43L: 容值:10uF;精度:±10%;额定电压:50V;材质(温度系数):X5R;; LCSC Part Name: 10uF ±10% 50V; Supplier Part: C440198; Manufacturer: muRata(村田); Supplier Footprint: 0805; JLCPCB Part Class: Basic Part; Datasheet: https://atta.szlcsc.com/upload/public/pdf/source/20230811/95AAE0C9AF55EDC31B7A4D8B733F534E.pdf; Supplier: LCSC; Tolerance: ±10%; Voltage Rated: 50V; Temperature Coefficient: X5R
CAN1 = GH1.25-2P-立式贴片: Supplier: LCSC; Supplier Part: C161690; Manufacturer: JST Sales America; Manufacturer Part: BM02B-GHS-TBT (LF)(SN); Check: false
J1 = GH1.25_4P_OK: Manufacturer: Changjiang Connectors; Supplier Part: C225125; Supplier: LCSC; Check: false
LED1 = FC-DA1608HRK-620D: Supplier: LCSC; Manufacturer: 国星光电; Manufacturer Part: NCD0603R1; Supplier Part: C84263; JLCPCB Part Class: Extended Part; link: https://so.szlcsc.com/global.html?k=C84263&amp;ref=editor; Check: false
LED2 = FC-D1608UGK-520D10: Supplier: LCSC; Manufacturer: 国星光电; Manufacturer Part: NCD0603G1; Supplier Part: C84267; JLCPCB Part Class: Extended Part; link: https://so.szlcsc.com/global.html?k=C84267&amp;ref=editor; Check: false
R3 R4 = 0603WAF4701T5E: 电阻类型:厚膜电阻;阻值:4.7kΩ;精度:±1%;功率:100mW;最大工作电压:75V;温度系数:±100ppm/℃;; LCSC Part Name: 4.7kΩ ±1% 100mW 厚膜电阻; Supplier Part: C23162; Manufacturer: UNI-ROYAL(厚声); Supplier Footprint: 0603; JLCPCB Part Class: Basic Part; Datasheet: https://atta.szlcsc.com/upload/public/pdf/source/20200306/C422600_1E6D84923E4A46A82E41ADD87F860B5C.pdf; Supplier: LCSC; Type: 厚膜电阻; Tolerance: ±1%; Power(Watts): 100mW; Overload Voltage (Max): 75V; Temperature Coefficient: ±100ppm/℃; Operating Temperature Range: -55℃~+155℃
R15 = 0603WAF1200T5E: 电阻类型:厚膜电阻;阻值:120Ω;精度:±1%;功率:100mW;最大工作电压:75V;温度系数:±100ppm/℃;; LCSC Part Name: 120Ω ±1% 100mW 厚膜电阻; Supplier Part: C22787; Manufacturer: UNI-ROYAL(厚声); Supplier Footprint: 0603; JLCPCB Part Class: Basic Part; Datasheet: https://atta.szlcsc.com/upload/public/pdf/source/20200306/C422600_1E6D84923E4A46A82E41ADD87F860B5C.pdf; Supplier: LCSC; Type: 厚膜电阻; Tolerance: ±1%; Power(Watts): 100mW; Overload Voltage (Max): 75V; Temperature Coefficient: ±100ppm/℃; Operating Temperature Range: -55℃~+155℃; Check: true
U1 = STM32G474CBT6: CPU最大主频:170MHz;应用领域:-;; Supplier Part: C730123; Manufacturer: ST(意法半导体); Supplier Footprint: LQFP-48(7x7); JLCPCB Part Class: 扩展库; Datasheet: https://atta.szlcsc.com/upload/public/pdf/source/20200902/C431632_38212262685EE30B1989689374F08940.pdf; Supplier: LCSC; CPU Maximum Speed: 170MHz; Program Storage Size: 128KB; GPIO Ports Number: 38; ADC (Bit): 12bit; DAC (Bit): 12bit; Low Voltage Detection Threshold: 1.71V~3.6V
U5 = SIT1044QTK/3: Supplier Part: C5308063; Manufacturer: SIT(芯力特); Supplier Footprint: DFN-8(3x3); JLCPCB Part Class: Extended Part; Datasheet: https://atta.szlcsc.com/upload/public/pdf/source/20220809/359F6B9372C41BBBF14C6B698796E042.pdf; Supplier: LCSC; Check: true
U27 = SX1M8.000M10F30TNN: 频率:8MHz;常温频差:±10ppm;输出模式:CMOS;工作电压:1.62V~3.63V;供电电流:10mA;频率稳定度(全温):±30ppm;; LCSC Part Name: 8MHz ±10ppm 1.62V~3.63V CMOS; Supplier Part: C2901607; Manufacturer: SCTF(星通时频); Supplier Footprint: SMD2016-4P; Datasheet: https://atta.szlcsc.com/upload/public/pdf/source/20211019/00ED133043D4FFB3578E73FB4951C66C.pdf; Supplier: LCSC; Normal temperature Frequency Tolerance: ±10ppm; Output Type: CMOS; Supply Voltage: 1.62V~3.63V; Supply Current (Max): 10mA; Frequency Stability(Full temperature range): ±30ppm; Operating Temperature: -40℃~+85℃
C22 C23 C28 = CL21A475KBQNNNE: 容值:4.7uF;精度:±10%;额定电压:50V;材质(温度系数):X5R;; LCSC Part Name: 4.7uF ±10% 50V; Supplier Part: C98192; Manufacturer: SAMSUNG(三星); Supplier Footprint: 0805; JLCPCB Part Class: Extended Part; Datasheet: https://atta.szlcsc.com/upload/public/pdf/source/20160218/1457707763339.pdf; Supplier: LCSC; Tolerance: ±10%; Voltage Rated: 50V; Temperature Coefficient: X5R
C126 C127 = CL21A226MAQNNNE: 容值:22uF;精度:±20%;额定电压:25V;材质(温度系数):X5R;; LCSC Part Name: 22uF ±20% 25V; Supplier Part: C45783; Manufacturer: SAMSUNG(三星); Supplier Footprint: 0805; JLCPCB Part Class: 基础库; Datasheet: https://atta.szlcsc.com/upload/public/pdf/source/20160218/1457707763339.pdf; Supplier: LCSC; Tolerance: ±20%; Voltage Rated: 25V; Temperature Coefficient: X5R
C128 = CL10A226MQ8NRNC: 容值:22uF;精度:±20%;额定电压:6.3V;材质(温度系数):X5R;; LCSC Part Name: 22uF ±20% 6.3V; Supplier Part: C59461; Manufacturer: SAMSUNG(三星); Supplier Footprint: 0603; JLCPCB Part Class: 基础库; Datasheet: https://atta.szlcsc.com/upload/public/pdf/source/20160218/1457707763339.pdf; Supplier: LCSC; Tolerance: ±20%; Voltage Rated: 6.3V; Temperature Coefficient: X5R
CN1 CN4 CN5 = XT30UPB-M: Supplier: LCSC; Supplier Part: C428721; Manufacturer: Changzhou Amass Elec; JLCPCB Part Class: Extended Part; Check: false
D1 = SS210_C14996: 正向压降(Vf):850mV@2A;直流反向耐压(Vr):100V;整流电流:2A;; LCSC Part Name: 电压:100V 电流:2A; Supplier Part: C14996; Manufacturer: MDD(辰达半导体); Supplier Footprint: SMA(DO-214AC); JLCPCB Part Class: Basic Part; Datasheet: https://atta.szlcsc.com/upload/public/pdf/source/20240710/8E54791437B168F7C5315E7E758CE84D.pdf; Supplier: LCSC; Forward Voltage (Vf@If): 850mV@2A; Reverse Voltage (Vr): 100V; Rectified Current: 2A; Reverse Leakage Current (Ir): 500uA@100V
L1 = GZ1608D601TF: 阻抗 @ 频率:600Ω@100MHz;误差:±25%;直流电阻(DCR):450mΩ;; LCSC Part Name: 单路 0603磁珠 阻抗600Ω@100MHz; Supplier Part: C1002; Manufacturer: Sunlord(顺络); Supplier Footprint: 0603; JLCPCB Part Class: Basic Part; Datasheet: https://atta.szlcsc.com/upload/public/pdf/source/20241120/893429B990C3BA07384E734821D2F218.pdf; Supplier: LCSC; Impedance @ Frequency: 600Ω@100MHz; Tolerance: ±25%; DC Resistance: 450mΩ; Current Rating: 200mA; Circuits: 1
L4 U11 = FTC252010S220MBCA: 电感值:22uH;精度:±20%;额定电流:850mA;饱和电流(Isat):1.1A;类型:一体成型电感;; LCSC Part Name: 22uH ±20% 1.1A; Supplier Part: C5832391; Manufacturer: cjiang(长江微电); Supplier Footprint: SMD,2x2.5mm; JLCPCB Part Class: Extended Part; Datasheet: https://atta.szlcsc.com/upload/public/pdf/source/20230602/8FFEDA9C0247A92A0D4B67554BFE4091.pdf; Supplier: LCSC; Tolerance: ±20%; Rated Current: 850mA; Saturation Current (Isat): 1.1A; DC Resistance (DCR): 1.1Ω; Type: 一体成型电感
L5 = FTC201610S4R7MBCA: 电感值:4.7uH;精度:±20%;额定电流:1.6A;饱和电流(Isat):2A;类型:一体成型电感;; LCSC Part Name: 4.7uH ±20% 2A; Supplier Part: C5832346; Manufacturer: cjiang(长江微电); Supplier Footprint: SMD,1.6x2mm; JLCPCB Part Class: 扩展库; Datasheet: https://atta.szlcsc.com/upload/public/pdf/source/20230602/8FFEDA9C0247A92A0D4B67554BFE4091.pdf; Supplier: LCSC; Tolerance: ±20%; Rated Current: 1.6A; Saturation Current (Isat): 2A; DC Resistance (DCR): 190mΩ; Type: 一体成型电感
R17 = 0603WAF1002T5E: 电阻类型:厚膜电阻;阻值:10kΩ;精度:±1%;功率:100mW;最大工作电压:75V;温度系数:±100ppm/℃;; LCSC Part Name: 厚膜电阻 10kΩ ±1% 100mW; Supplier Part: C25804; Manufacturer: UNI-ROYAL(厚声); Supplier Footprint: 0603; JLCPCB Part Class: Basic Part; Datasheet: https://atta.szlcsc.com/upload/public/pdf/source/20200306/C422600_1E6D84923E4A46A82E41ADD87F860B5C.pdf; Supplier: LCSC; Type: 厚膜电阻; Tolerance: ±1%; Power(Watts): 100mW; Overload Voltage (Max): 75V; Temperature Coefficient: ±100ppm/℃; Operating Temperature Range: -55℃~+155℃; link: https://so.szlcsc.com/global.html?k=C25804&amp;ref=editor; Check: true
R30 R31 R45 R46 = 0Ω: Supplier: LCSC; Manufacturer: UNI-ROYAL(厚声); Manufacturer Part: 0603WAF0000T5E; Supplier Part: C21189; JLCPCB Part Class: Basic Part; link: https://so.szlcsc.com/global.html?k=C21189&amp;ref=editor; Check: false
R47 = 0603WAF1003T5E: 电阻类型:厚膜电阻;阻值:100kΩ;精度:±1%;功率:100mW;最大工作电压:75V;温度系数:±100ppm/℃;; LCSC Part Name: 100kΩ ±1% 100mW 厚膜电阻; Supplier Part: C25803; Manufacturer: UNI-ROYAL(厚声); Supplier Footprint: 0603; JLCPCB Part Class: Basic Part; Datasheet: https://atta.szlcsc.com/upload/public/pdf/source/20200306/C422600_1E6D84923E4A46A82E41ADD87F860B5C.pdf; Supplier: LCSC; Type: 厚膜电阻; Tolerance: ±1%; Power(Watts): 100mW; Overload Voltage (Max): 75V; Temperature Coefficient: ±100ppm/℃; Operating Temperature Range: -55℃~+155℃; link: https://so.szlcsc.com/global.html?k=C25803&amp;ref=editor; Check: true
R60 = 0603WAF5602T5E: 电阻类型:厚膜电阻;阻值:56kΩ;精度:±1%;功率:100mW;最大工作电压:75V;温度系数:±100ppm/℃;; LCSC Part Name: 56kΩ ±1% 100mW 厚膜电阻; Supplier Part: C23206; Manufacturer: UNI-ROYAL(厚声); Supplier Footprint: 0603; JLCPCB Part Class: Basic Part; Datasheet: https://atta.szlcsc.com/upload/public/pdf/source/20200306/C422600_1E6D84923E4A46A82E41ADD87F860B5C.pdf; Supplier: LCSC; Type: 厚膜电阻; Tolerance: ±1%; Power(Watts): 100mW; Overload Voltage (Max): 75V; Temperature Coefficient: ±100ppm/℃; Operating Temperature Range: -55℃~+155℃; Check: true
R61 = FRC0603F1072TS: 电阻类型:厚膜电阻;阻值:10.7kΩ;精度:±1%;功率:100mW;最大工作电压:75V;温度系数:±100ppm/℃;; LCSC Part Name: 10.7kΩ ±1% 100mW 厚膜电阻; Supplier Part: C5153968; Manufacturer: FOJAN(富捷); Supplier Footprint: 0603; JLCPCB Part Class: Extended Part; Datasheet: https://atta.szlcsc.com/upload/public/pdf/source/20211221/925EC7D7225764EE0046F22065062C87.pdf; Supplier: LCSC; Type: 厚膜电阻; Tolerance: ±1%; Power(Watts): 100mW; Overload Voltage (Max): 75V; Temperature Coefficient: ±100ppm/℃; Check: true; Operating Temperature Range: -55℃~+155℃
R64 R81 = 0603WAF1002T5E: 电阻类型:厚膜电阻;阻值:10kΩ;精度:±1%;功率:100mW;最大工作电压:75V;温度系数:±100ppm/℃;; LCSC Part Name: 厚膜电阻 10kΩ ±1% 100mW; Supplier Part: C25804; Manufacturer: UNI-ROYAL(厚声); Supplier Footprint: 0603; JLCPCB Part Class: Basic Part; Datasheet: https://atta.szlcsc.com/upload/public/pdf/source/20200306/C422600_1E6D84923E4A46A82E41ADD87F860B5C.pdf; Supplier: LCSC; Type: 厚膜电阻; Tolerance: ±1%; Power(Watts): 100mW; Overload Voltage (Max): 75V; Temperature Coefficient: ±100ppm/℃; Operating Temperature Range: -55℃~+155℃
R65 = 0603WAF1004T5E: 电阻类型:厚膜电阻;阻值:1MΩ;精度:±1%;功率:100mW;最大工作电压:75V;温度系数:±100ppm/℃;; LCSC Part Name: 1MΩ ±1% 100mW 厚膜电阻; Supplier Part: C22935; Manufacturer: UNI-ROYAL(厚声); Supplier Footprint: 0603; JLCPCB Part Class: Basic Part; Datasheet: https://atta.szlcsc.com/upload/public/pdf/source/20200306/C422600_1E6D84923E4A46A82E41ADD87F860B5C.pdf; Supplier: LCSC; Type: 厚膜电阻; Tolerance: ±1%; Power(Watts): 100mW; Overload Voltage (Max): 75V; Temperature Coefficient: ±100ppm/℃; Operating Temperature Range: -55℃~+155℃
R80 = 0603WAF2201T5E: 电阻类型:厚膜电阻;阻值:2.2kΩ;精度:±1%;功率:100mW;最大工作电压:75V;温度系数:±100ppm/℃;; LCSC Part Name: 2.2kΩ ±1% 100mW 厚膜电阻; Supplier Part: C4190; Manufacturer: UNI-ROYAL(厚声); Supplier Footprint: 0603; JLCPCB Part Class: 基础库; Datasheet: https://atta.szlcsc.com/upload/public/pdf/source/20200306/C422600_1E6D84923E4A46A82E41ADD87F860B5C.pdf; Supplier: LCSC; Type: 厚膜电阻; Tolerance: ±1%; Power(Watts): 100mW; Overload Voltage (Max): 75V; Temperature Coefficient: ±100ppm/℃; Operating Temperature Range: -55℃~+155℃
U3 = LGS5116B: 功能类型:降压型;输入电压:4.5V~16V;输出电压:800mV~12V;输出电流(最大值):2A;; Supplier Part: C5818961; Manufacturer: Legend-Si(棱晶半导体); Supplier Footprint: SOT23-6; JLCPCB Part Class: 扩展库; Datasheet: https://atta.szlcsc.com/upload/public/pdf/source/20230512/E333B4D1849F2BD1668D55CA883123F4.pdf; Supplier: LCSC; Function: 降压型; Input Voltage: 4.5V~16V; Output Voltage: 800mV~12V; Output Current (Max): 2A
U6 U21 = LGS5148: Supplier: LCSC; Supplier Part: C5123972; Manufacturer: Legend-Si(棱晶半导体); JLCPCB Part Class: Extended Part; Check: false
U7 = REF3030AIDBZR: Supplier: LCSC; Manufacturer: TI(德州仪器); Supplier Part: C38423; JLCPCB Part Class: Extended Part; link: https://so.szlcsc.com/global.html?k=C38423&amp;ref=editor; Check: false
U12 = HE9073A33M5R: Supplier: LCSC; Supplier Part: C723789; Manufacturer: HEERMICR(赫尔半导体); JLCPCB Part Class: Extended Part; Check: false
U23 = 0603WAF1133T5E: 电阻类型:厚膜电阻;阻值:113kΩ;精度:±1%;功率:100mW;最大工作电压:75V;温度系数:±100ppm/℃;; LCSC Part Name: 113kΩ ±1% 100mW 厚膜电阻; Supplier Part: C22862; Manufacturer: UNI-ROYAL(厚声); Supplier Footprint: 0603; JLCPCB Part Class: Extended Part; Datasheet: https://atta.szlcsc.com/upload/public/pdf/source/20200306/C422600_1E6D84923E4A46A82E41ADD87F860B5C.pdf; Supplier: LCSC; Type: 厚膜电阻; Tolerance: ±1%; Power(Watts): 100mW; Overload Voltage (Max): 75V; Temperature Coefficient: ±100ppm/℃; Operating Temperature Range: -55℃~+155℃
C10 C12 = 0603B103K500NT: 容值:10nF;精度:±10%;额定电压:50V;材质(温度系数):X7R;; LCSC Part Name: 10nF ±10% 50V; Supplier Part: C57112; Manufacturer: FH(风华); Supplier Footprint: 0603; JLCPCB Part Class: Basic Part; Datasheet: https://atta.szlcsc.com/upload/public/pdf/source/20200305/C486355_26A10D38EF8C2A5C37091D0039909270.pdf; Supplier: LCSC; Tolerance: ±10%; Voltage Rated: 50V; Temperature Coefficient: X7R; Check: true
C30 C41 = CL05B103KB5NNNC: 容值:10nF;精度:±10%;额定电压:50V;材质(温度系数):X7R;; LCSC Part Name: 10nF ±10% 50V; Supplier Part: C15195; Manufacturer: SAMSUNG(三星); Supplier Footprint: 0402; JLCPCB Part Class: Basic Part; Datasheet: https://atta.szlcsc.com/upload/public/pdf/source/20160218/1457707763339.pdf; Supplier: LCSC; Tolerance: ±10%; Voltage Rated: 50V; Temperature Coefficient: X7R
C118 = CGA0402C0G510J500GT: 容值:51pF;精度:±5%;额定电压:50V;材质(温度系数):C0G;; LCSC Part Name: 51pF ±5% 50V; Supplier Part: C22435956; Manufacturer: HRE(芯声); Supplier Footprint: 0402; JLCPCB Part Class: 扩展库; Datasheet: https://atta.szlcsc.com/upload/public/pdf/source/20240523/648116A361224A3868DCF4862AC2F79A.pdf; Supplier: LCSC; Tolerance: ±5%; Voltage Rated: 50V; Temperature Coefficient: C0G
C119 = GCM1555C1H101JA16D: 容值:100pF;精度:±5%;额定电压:50V;材质(温度系数):C0G;; LCSC Part Name: 100pF ±5% 50V; Supplier Part: C126492; Manufacturer: muRata(村田); Supplier Footprint: 0402; JLCPCB Part Class: 扩展库; Datasheet: https://atta.szlcsc.com/upload/public/pdf/source/20170912/C126492_1505207894513963589.pdf; Supplier: LCSC; Tolerance: ±5%; Voltage Rated: 50V; Temperature Coefficient: C0G
R9 R14 = 0603WAF3300T5E: 电阻类型:厚膜电阻;阻值:330Ω;精度:±1%;功率:100mW;最大工作电压:75V;温度系数:±100ppm/℃;; LCSC Part Name: 330Ω ±1% 100mW 厚膜电阻; Supplier Part: C23138; Manufacturer: UNI-ROYAL(厚声); Supplier Footprint: 0603; JLCPCB Part Class: Basic Part; Datasheet: https://atta.szlcsc.com/upload/public/pdf/source/20200306/C422600_1E6D84923E4A46A82E41ADD87F860B5C.pdf; Supplier: LCSC; Type: 厚膜电阻; Tolerance: ±1%; Power(Watts): 100mW; Overload Voltage (Max): 75V; Temperature Coefficient: ±100ppm/℃; Operating Temperature Range: -55℃~+155℃; link: https://so.szlcsc.com/global.html?k=C22859&amp;ref=editor; Check: true
R18 R21 = 0402WGF3300TCE: 电阻类型:厚膜电阻;阻值:330Ω;精度:±1%;功率:62.5mW;最大工作电压:50V;温度系数:±100ppm/℃;; LCSC Part Name: 330Ω ±1% 62.5mW 厚膜电阻; Supplier Part: C25104; Manufacturer: UNI-ROYAL(厚声); Supplier Footprint: 0402; JLCPCB Part Class: Basic Part; Datasheet: https://atta.szlcsc.com/upload/public/pdf/source/20200306/C422600_1E6D84923E4A46A82E41ADD87F860B5C.pdf; Supplier: LCSC; Type: 厚膜电阻; Tolerance: ±1%; Power(Watts): 62.5mW; Overload Voltage (Max): 50V; Temperature Coefficient: ±100ppm/℃; Operating Temperature Range: -55℃~+155℃
R32-R36 R38 = 0402WGF100JTCE: 电阻类型:厚膜电阻;阻值:10Ω;精度:±1%;功率:62.5mW;最大工作电压:50V;温度系数:±200ppm/℃;; LCSC Part Name: 10Ω ±1% 62.5mW 厚膜电阻; Supplier Part: C25077; Manufacturer: UNI-ROYAL(厚声); Supplier Footprint: 0402; JLCPCB Part Class: Basic Part; Datasheet: https://atta.szlcsc.com/upload/public/pdf/source/20200306/C422600_1E6D84923E4A46A82E41ADD87F860B5C.pdf; Supplier: LCSC; Type: 厚膜电阻; Tolerance: ±1%; Power(Watts): 62.5mW; Overload Voltage (Max): 50V; Temperature Coefficient: ±200ppm/℃; Operating Temperature Range: -55℃~+155℃
R70-R73 = RT0603BRD074K7L: 电阻类型:薄膜电阻;阻值:4.7kΩ;精度:±0.1%;功率:100mW;最大工作电压:75V;温度系数:±25ppm/℃;; LCSC Part Name: 薄膜电阻 4.7kΩ ±0.1% 100mW; Supplier Part: C513565; Manufacturer: YAGEO(国巨); Supplier Footprint: 0603; Datasheet: https://atta.szlcsc.com/upload/public/pdf/source/20200415/C513565_14F3B130D24611968EA668DD945D5325.pdf; Supplier: LCSC; Type: 薄膜电阻; Tolerance: ±0.1%; Power(Watts): 100mW; Overload Voltage (Max): 75V; Temperature Coefficient: ±25ppm/℃; Operating Temperature Range: -55℃~+155℃
R74-R77 = RT0603BRD0751KL: 电阻类型:薄膜电阻;阻值:51kΩ;精度:±0.1%;功率:100mW;最大工作电压:75V;温度系数:±25ppm/℃;; LCSC Part Name: 薄膜电阻 51kΩ ±0.1% 100mW; Supplier Part: C861458; Manufacturer: YAGEO(国巨); Supplier Footprint: 0603; Datasheet: https://atta.szlcsc.com/upload/public/pdf/source/20210709/C861458_B07C6FAEF2B3A6A40F135D9DC074A47F.pdf; Supplier: LCSC; Type: 薄膜电阻; Tolerance: ±0.1%; Power(Watts): 100mW; Overload Voltage (Max): 75V; Temperature Coefficient: ±25ppm/℃; Operating Temperature Range: -55℃~+155℃
R78 R79 = 0402WGF4702TCE: 电阻类型:厚膜电阻;阻值:47kΩ;精度:±1%;功率:62.5mW;最大工作电压:50V;温度系数:±100ppm/℃;; LCSC Part Name: 47kΩ ±1% 62.5mW 厚膜电阻; Supplier Part: C25792; Manufacturer: UNI-ROYAL(厚声); Supplier Footprint: 0402; JLCPCB Part Class: 基础库; Datasheet: https://atta.szlcsc.com/upload/public/pdf/source/20200306/C422600_1E6D84923E4A46A82E41ADD87F860B5C.pdf; Supplier: LCSC; Type: 厚膜电阻; Tolerance: ±1%; Power(Watts): 62.5mW; Overload Voltage (Max): 50V; Temperature Coefficient: ±100ppm/℃; Operating Temperature Range: -55℃~+155℃
U15-U17 = INA240A2QPWRQ1: Supplier: LCSC; Supplier Part: C544529; Manufacturer: TI(德州仪器); link: https://so.szlcsc.com/global.html?k=C544529&amp;ref=editor; Check: false
U24 U25 = LTC8333XC5/R6: Supplier Part: C2888136; Manufacturer: Linearin(先积集成); Supplier Footprint: SC-70-5L; Datasheet: https://atta.szlcsc.com/upload/public/pdf/source/20210918/C2888136_DABB23E88946B910805FA0FC8E5D1079.pdf; Supplier: LCSC
U26 = LTC8631XT5/R6: 压摆率(SR):8.5V/us;; Supplier Part: C2888144; Manufacturer: Linearin(先积集成); Supplier Footprint: SOT-23-5L; JLCPCB Part Class: 扩展库; Datasheet: https://atta.szlcsc.com/upload/public/pdf/source/20210918/C2888144_7E4829B6D82B7C55EFD7207D980C1768.pdf; Supplier: LCSC; Slew Rate(SR): 8.5V/us

## Nets
3V3: C1.2 C32.2 L1.1 U12.5(VOUT)
3VR: C40.2 U1.20(VREF+) U7.2(OUT) U15.6(REF2) U16.6(REF2) U17.6(REF2)
5V: C14.2 C25.1 C26.1 C31.1 C126.2 C127.2 C130.2 L4.2 R60.2 U3.4(EN) U3.5(VIN) U5.3(VCC) U12.1(VIN) U12.3(CE)
10V: C18.1 C19.1 C20.1 C27.2 C28.2 C113.1 C114.1 R65.2 U11.2 U19.1(VDD) U20.1(VDD) U21.5(VIN) U23.2
24V: C21.2 C22.2 C23.2 D1.1(K) R47.2 U6.5(VIN)
A3V3: C2.2 C3.2 C29.1 C34.1 C37.1 C39.2 C116.1 C117.1 C120.2 L1.2 U1.21(VDDA) U7.1(IN) U15.5(VS) U16.5(VS) U17.5(VS) U24.5(﹢VS) U25.5(﹢VS) U26.5(+VS)
AGND: C1.1 C2.1 C3.1 C10.2 C12.2 C29.2 C30.1 C34.2 C37.2 C39.1 C40.1 C41.1 C116.2 C117.2 C118.1 C120.1 R30.1 R46.1 U1.19(VSSA) U7.3(GND) U15.1(NC) U15.4(GND) U15.7(REF1) U16.1(NC) U16.4(GND) U16.7(REF1) U17.1(NC) U17.4(GND) U17.7(REF1) U24.2(﹣VS) U25.2(﹣VS) U26.2(-VS)
D3V3: C4.2 C5.2 C6.2 C7.2 C8.2 C15.2 C125.1 C128.1 L5.2 R4.1 R81.2 U1.1(VBAT) U1.24(VDD) U1.36(VDD) U1.48(VDD) U5.5(VIO) U27.1(ENABLECONTROL) U27.4(VDD)
GND: C4.1 C5.1 C6.1 C7.1 C8.1 C13.1 C14.1 C15.1 C18.2 C19.2 C20.2 C21.1 C22.1 C23.1 C25.2 C26.2 C27.1 C28.1 C31.2 C32.1 C125.2 C126.1 C127.1 C128.2 C130.1 CAN1.3 CAN1.4 J1.2 LED1.1(K) LED2.1(K) R10.2 R17.1 R30.2 R31.2 R45.2 R46.2 R61.1 R64.1 R80.1 U1.23(VSS) U1.35(VSS) U1.47(VSS) U3.2(GND) U5.2(GND) U5.8(STB) U5.9(EP) U6.2(GND) U12.2(GND) U21.2(GND) U27.2(GND)
PGND: C44.1 C45.1 C46.2 C47.2 C49.1 C50.1 C51.1 C59.2 C113.2 C114.2 C115.2 C121.1 C122.1 C123.1 C131.1 C132.1 CN1.1(-) CN4.1(-) CN5.1(-) D2.2 D3.1 D13.1(A) D13.3(A) D14.1(A) D14.3(A) Q4.1(S) Q4.2(S) Q4.3(S) Q5.1(S) Q5.2(S) Q5.3(S) R31.1 R45.1 R51.1 R52.1 R56.1 R57.1 R68.1 R69.1 R70.1 R71.1 R74.1 R76.1 U19.7(VSS) U20.7(VSS)
VBAT+: C59.1 CN4.2(+) D2.1 R32.1 R39.1 R40.1 R77.1
ADC1_I_BAT: C119.1 U1.10(PA2) U26.1(OUT) U26.4(IN-)
ADC1_I_IN: C41.2 R21.2 U1.9(PA1)
ADC1_I_OUT: C30.2 R18.2 U1.17(PB1)
ADC1_VIN: C10.1 R9.2 U1.8(PA0)
ADC1_VOUT: C12.1 R14.2 U1.11(PA3)
BOOT0: R10.1 U1.45(PB8-BOOT0)
CAN_H: CAN1.2 R15.1 U5.7(CANH)
CAN_L: CAN1.1 R15.2 U5.6(CANL)
CAN_RX: R83.2 U5.4(RXD)
CAN_TX: R82.2 U5.1(TXD)
G1_H: R48.1 U20.3(HO)
G1_L: R49.1 U20.8(LO)
G2_H: R54.2 U19.3(HO)
G2_L: R55.2 U19.8(LO)
I_BAT: R78.1 U15.8(OUT)
LED_STATE: R3.1 U1.2(PC13)
NRST: C13.2 U1.7(PG10-NRST)
OSC_IN: U1.5(PF0-OSC_IN) U27.3(Output)
PWM_A_H: R67.2 U1.30(PA8)
PWM_A_L: R66.2 U1.31(PA9)
PWM_B_H: R58.2 U1.26(PB12)
PWM_B_L: R59.2 U1.27(PB13)
SW1: C111.1 D12.1(A) D12.3(A) D13.2(K) L3.2 Q1.1(S) Q1.2(S) Q1.3(S) Q4.5(D) Q4.6(D) Q4.7(D) Q4.8(D) Q4.9(D) R53.1 U20.4(HS)
SW2: C112.1 D14.2(K) D15.1(A) D15.3(A) L3.1 Q3.1(S) Q3.2(S) Q3.3(S) Q5.5(D) Q5.6(D) Q5.7(D) Q5.8(D) Q5.9(D) R50.1 U19.4(HS)
SWCLK: R1.2 U1.38(PA14)
SWDIO: R2.2 U1.37(PA13)
VBOOST: C46.1 C49.2 C50.2 C51.2 C121.2 C131.2 D15.2(K) Q3.5(D) Q3.6(D) Q3.7(D) Q3.8(D) Q3.9(D) R34.1 R43.1 R44.1
VBUCK: C44.2 C45.2 C47.1 C122.2 C123.2 C132.2 D12.2(K) Q1.5(D) Q1.6(D) Q1.7(D) Q1.8(D) Q1.9(D) R38.1 R41.2 R42.2
VCAP+: C115.1 CN1.2(+) D3.2 R35.1 R43.2 R44.2 R75.1
VCHASSIS+: CN5.2(+) D1.2(A) R33.1 R36.1 R39.2 R40.2 R41.1 R42.1
$1N38: J1.3 R1.1
$1N41: J1.4 R2.1
$1N998: LED2.2(A) R3.2
$1N999: LED1.2(A) R4.2
$1N16846: R83.1 U1.33(PA11)
$1N16848: R82.1 U1.34(PA12)
$2N10: R64.2 U6.3(FB) U23.1
$2N11: C17.2 U6.6(SW) U11.1
$2N12: C17.1 U6.1(BST)
$2N68: R17.2 R47.1 U6.4(EN)
$2N18642: R60.1 R61.2 U21.3(FB)
$2N18643: C24.2 L4.1 U21.6(SW)
$2N18644: C24.1 U21.1(BST)
$2N18656: R65.1 U21.4(EN)
$2N36767: C124.2 L5.1 U3.6(SW)
$2N36769: C124.1 U3.1(BST)
$2N38911: R80.2 R81.1 U3.3(FB)
$3N48: R67.1 R69.2 U19.5(HI)
$3N49: R66.1 R68.2 U19.6(LI)
$3N12544: Q1.4(G) R48.2 R53.2
$3N12574: Q4.4(G) R49.2 R52.2
$3N12747: Q3.4(G) R50.2 R54.1
$3N12777: Q5.4(G) R51.2 R55.1
$3N13252: R57.2 R58.1 U20.5(HI)
$3N13253: R56.2 R59.1 U20.6(LI)
$3N13344: C112.2 U19.2(HB)
$3N13359: C111.2 U20.2(HB)
$4N408: R71.2 R75.2 U24.1(﹢IN)
$4N414: R9.1 R72.2 U24.4(OUT)
$4N415: R72.1 R74.2 U24.3(﹣IN)
$4N793: R70.2 R77.2 U25.1(﹢IN)
$4N795: R14.1 R73.2 U25.4(OUT)
$4N797: R73.1 R76.2 U25.3(﹣IN)
$4N1095: C118.2 R79.2 U26.3(IN+)
$4N1098: C119.2 R78.2 R79.1
$4N1460: C38.2 R34.2 U16.2(IN+)
$4N1461: C38.1 R35.2 U16.3(IN-)
$4N1465: R18.1 U16.8(OUT)
$4N1760: C33.2 R32.2 U15.2(IN+)
$4N1761: C33.1 R33.2 U15.3(IN-)
$4N2130: C36.2 R36.2 U17.2(IN+)
$4N2131: C36.1 R38.2 U17.3(IN-)
$4N2136: R21.1 U17.8(OUT)

Not connected (* = marked no-connect by the designer): J1 1*; U1 3(PC14-OSC32_IN) 4(PC15-OSC32_OUT) 6(PF1-OSC_OUT) 12(PA4) 13(PA5) 14(PA6) 15(PA7) 16(PB0) 18(PB2) 22(PB10) 25(PB11) 28(PB14) 29(PB15) 32(PA10) 39(PA15) 40(PB3) 41(PB4) 42(PB5) 43(PB6) 44(PB7) 46(PB9); U12 4(NC)*

## Notes on the sheets
sheet 1
- MCU
- MCU外围电容
- MCU复位和BOOT
- MCU外围HSE晶振
- MCU下载口
- 调试LED
- CAN通讯
sheet 2
- “单点”接地
- 24V降10V
- 5V降D3.3V
- 10V降5V
- Π型滤波
- XT30接口
- 5V降A3.3V
- A3.3V降3V参考
sheet 3
- BUCK-BOOST
- BUCK-BOOST电容
- 栅极驱动
sheet 4
- 输出电压差分采样
- 输入电压差分采样
- 输入电流二阶低通
- 电容输出电流采样
- 底盘输入电流采样
- 底盘输出电流采样
- 采样电阻
